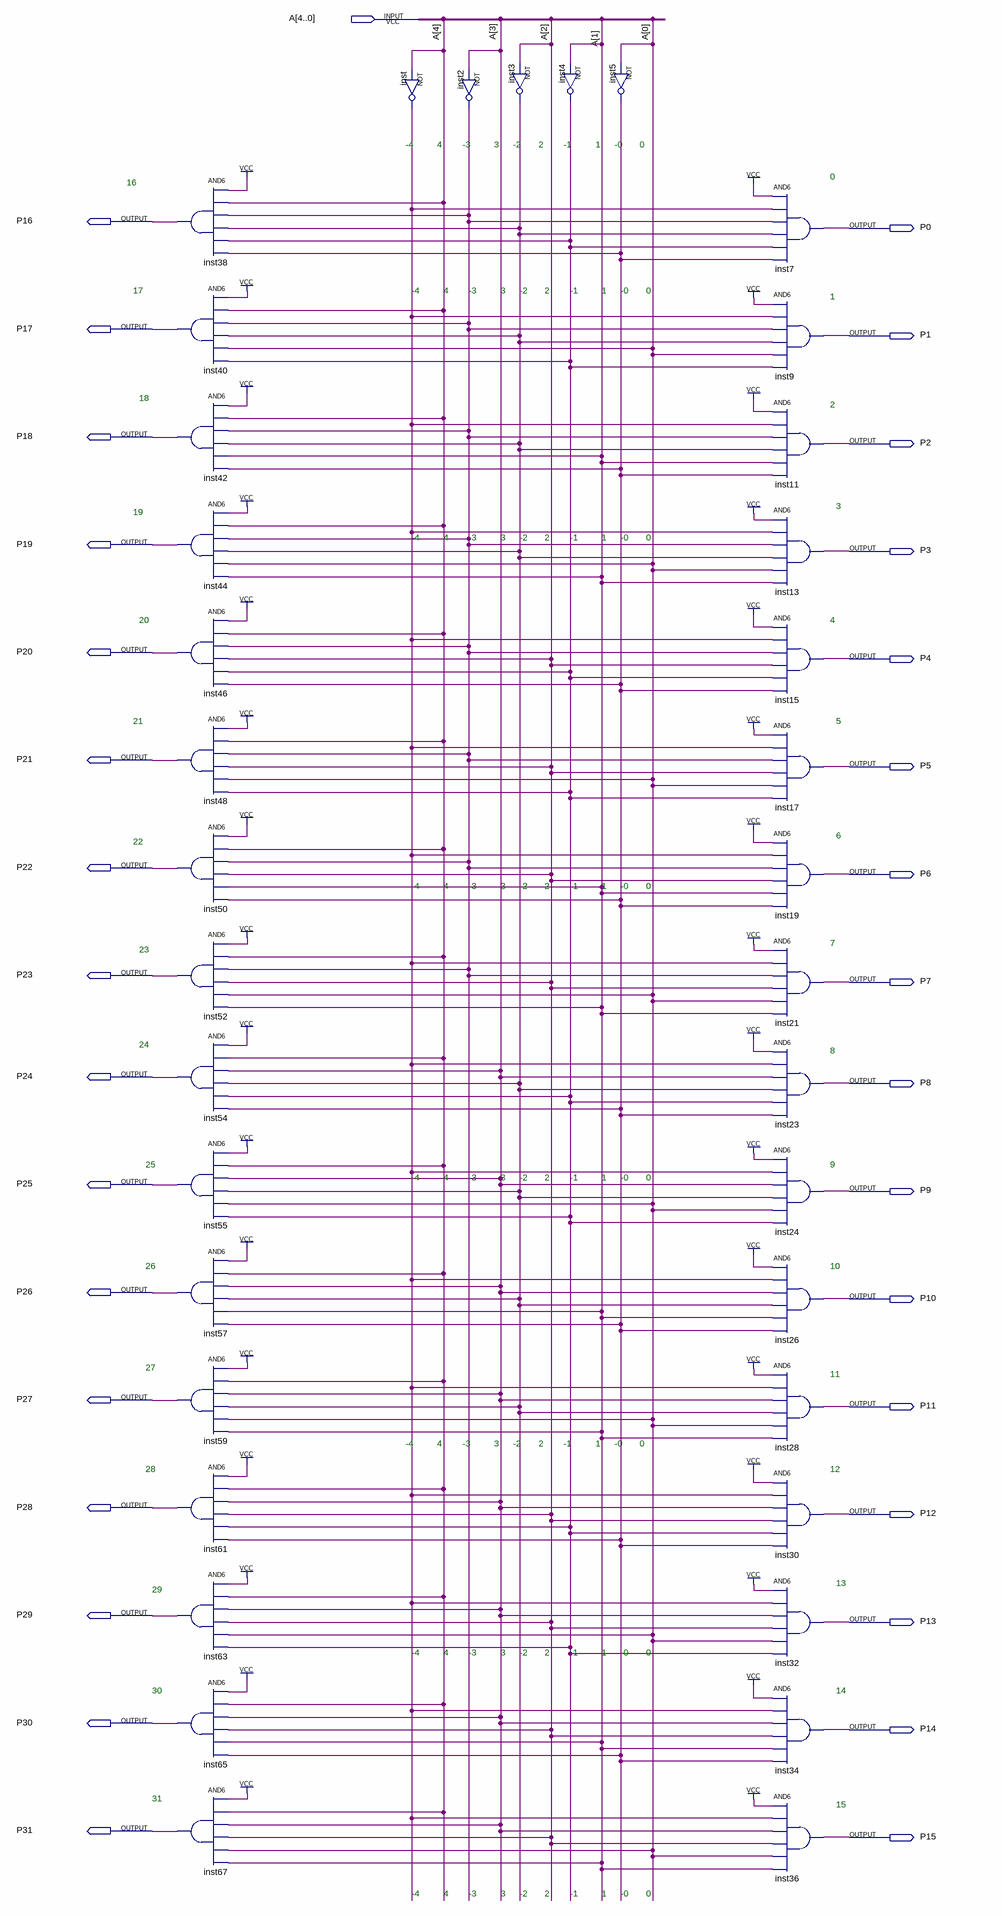
[diagram p0: schematic sheet]
// Quartus schematic Decodificador_de_5bits_modulo.bdf as structural Verilog: 37 symbols, 33 pins
module Decodificador_de_5bits_modulo (
  input  [4:0] A,
  output P16,
  output P0,
  output P17,
  output P1,
  output P18,
  output P2,
  output P19,
  output P3,
  output P20,
  output P4,
  output P21,
  output P5,
  output P22,
  output P6,
  output P23,
  output P7,
  output P24,
  output P8,
  output P25,
  output P9,
  output P26,
  output P10,
  output P27,
  output P11,
  output P28,
  output P12,
  output P29,
  output P13,
  output P30,
  output P14,
  output P31,
  output P15
);

  wire inst2_out, inst3_out, inst4_out, inst5_out, inst_out;

  and inst38 (P16, 1'b1, A[4], inst2_out, inst3_out, inst4_out, inst5_out);
  and inst40 (P17, 1'b1, A[4], inst2_out, inst3_out, A[0], inst4_out);
  and inst42 (P18, 1'b1, A[4], inst2_out, inst3_out, A[1], inst5_out);
  and inst44 (P19, 1'b1, A[4], inst2_out, inst3_out, A[0], A[1]);
  and inst46 (P20, 1'b1, A[4], inst2_out, A[2], inst4_out, inst5_out);
  and inst48 (P21, 1'b1, A[4], inst2_out, A[2], A[0], inst4_out);
  and inst50 (P22, 1'b1, A[4], inst2_out, A[2], A[1], inst5_out);
  and inst52 (P23, 1'b1, A[4], inst2_out, A[2], A[0], A[1]);
  and inst54 (P24, 1'b1, A[4], A[3], inst3_out, inst4_out, inst5_out);
  and inst55 (P25, 1'b1, A[4], A[3], inst3_out, A[0], inst4_out);
  and inst57 (P26, 1'b1, A[4], A[3], inst3_out, A[1], inst5_out);
  and inst59 (P27, 1'b1, A[4], A[3], inst3_out, A[0], A[1]);
  and inst61 (P28, 1'b1, A[4], A[3], A[2], inst4_out, inst5_out);
  and inst63 (P29, 1'b1, A[4], A[3], A[2], A[0], inst4_out);
  and inst65 (P30, 1'b1, A[4], A[3], A[2], A[1], inst5_out);
  and inst67 (P31, 1'b1, A[4], A[3], A[2], A[0], A[1]);
  not inst (inst_out, A[4]);
  not inst2 (inst2_out, A[3]);
  not inst3 (inst3_out, A[2]);
  not inst4 (inst4_out, A[1]);
  not inst5 (inst5_out, A[0]);
  and inst7 (P0, 1'b1, inst_out, inst2_out, inst3_out, inst4_out, inst5_out);
  and inst9 (P1, 1'b1, inst_out, inst2_out, inst3_out, A[0], inst4_out);
  and inst11 (P2, 1'b1, inst_out, inst2_out, inst3_out, A[1], inst5_out);
  and inst13 (P3, 1'b1, inst_out, inst2_out, inst3_out, A[0], A[1]);
  and inst15 (P4, 1'b1, inst_out, inst2_out, A[2], inst4_out, inst5_out);
  and inst17 (P5, 1'b1, inst_out, inst2_out, A[2], A[0], inst4_out);
  and inst19 (P6, 1'b1, inst_out, inst2_out, A[2], A[1], inst5_out);
  and inst21 (P7, 1'b1, inst_out, inst2_out, A[2], A[0], A[1]);
  and inst23 (P8, 1'b1, inst_out, A[3], inst3_out, inst4_out, inst5_out);
  and inst24 (P9, 1'b1, inst_out, A[3], inst3_out, A[0], inst4_out);
  and inst26 (P10, 1'b1, inst_out, A[3], inst3_out, A[1], inst5_out);
  and inst28 (P11, 1'b1, inst_out, A[3], inst3_out, A[0], A[1]);
  and inst30 (P12, 1'b1, inst_out, A[3], A[2], inst4_out, inst5_out);
  and inst32 (P13, 1'b1, inst_out, A[3], A[2], A[0], inst4_out);
  and inst34 (P14, 1'b1, inst_out, A[3], A[2], A[1], inst5_out);
  and inst36 (P15, 1'b1, inst_out, A[3], A[2], A[0], A[1]);

  // Notes on the sheet:
  //   -4
  //   4
  //   -3
  //   3
  //   -2
  //   2
  //   -1
  //   1
  //   -0
  //   0
  //   0
  //   16
  //   17
  //   -4
  //   4
  //   -3
  //   3
  //   -2
  //   2
  //   -1
  //   1
  //   -0
  //   0
  //   1
  //   18
  //   2
  //   3
  //   19
  //   -4
  //   4
  //   -3
  //   3
  //   -2
  //   2
  //   -1
  //   1
  //   -0
  //   0
  //   20
  //   4
  //   21
  //   5
  //   6
  //   22
  //   -4
  //   4
  //   -3
  //   3
  //   -2
  //   2
  //   -1
  //   1
  //   -0
  //   0
  //   7
  //   23
  //   24
  //   8
  //   25
  //   9
  //   -4
  //   4
  //   -3
  //   3
  //   -2
  //   2
  //   -1
  //   1
  //   -0
  //   0
  //   26
  //   10
  //   27
  //   11
  //   -4
  //   4
  //   -3
  //   3
  //   -2
  //   2
  //   -1
  //   1
  //   -0
  //   0
  //   28
  //   12
  //   13
  //   29
  //   -4
  //   4
  //   -3
  //   3
  //   -2
  //   2
  //   -1
  //   1
  //   -0
  //   0
  //   30
  //   14
  //   31
  //   15
  //   -4
  //   4
  //   -3
  //   3
  //   -2
  //   2
  //   -1
  //   1
  //   -0
  //   0
endmodule
